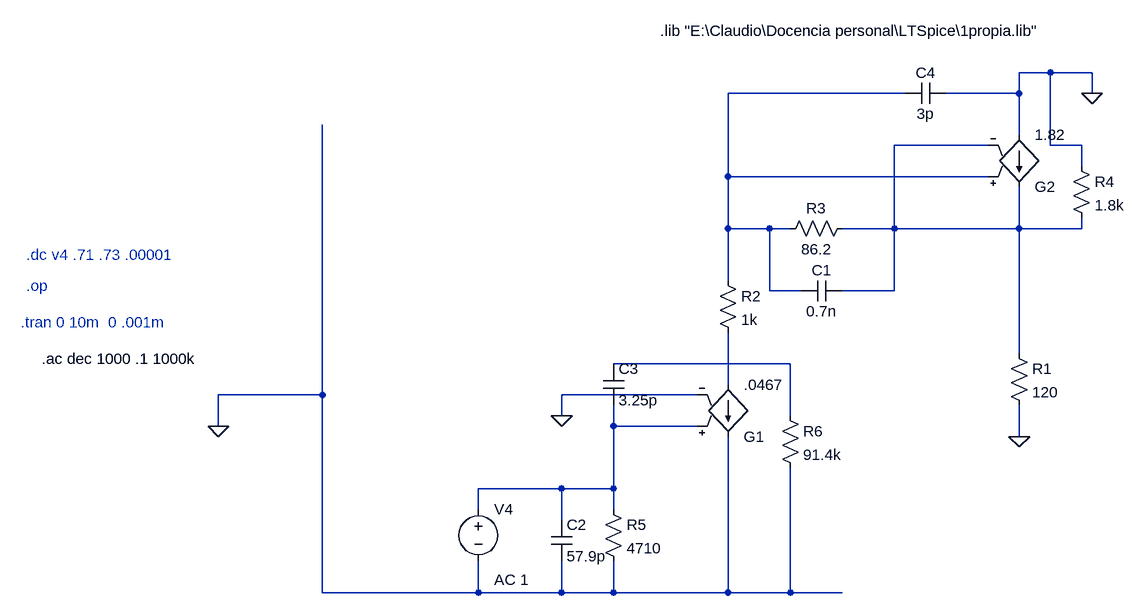
[diagram p0: schematic clase ab respuesta en frecuencia b.asc]
clase ab respuesta en frecuencia b.asc, the LTspice schematic file:
Version 4
SHEET 1 1392 984
WIRE 608 80 560 80
WIRE 672 80 608 80
WIRE 384 112 112 112
WIRE 560 112 560 80
WIRE 560 112 448 112
WIRE 672 112 672 80
WIRE 560 176 560 112
WIRE 512 192 368 192
WIRE 608 192 608 80
WIRE 656 192 608 192
WIRE 656 224 656 192
WIRE 112 240 112 112
WIRE 512 240 112 240
WIRE 112 320 112 240
WIRE 176 320 112 320
WIRE 208 320 176 320
WIRE 368 320 368 192
WIRE 368 320 288 320
WIRE 560 320 560 256
WIRE 560 320 368 320
WIRE 656 320 656 304
WIRE 656 320 560 320
WIRE 112 400 112 320
WIRE 176 416 176 320
WIRE 224 416 176 416
WIRE 368 416 368 320
WIRE 368 416 288 416
WIRE 560 512 560 320
WIRE 208 528 -64 528
WIRE 112 560 112 480
WIRE -512 576 -512 160
WIRE -512 576 -672 576
WIRE 64 576 -144 576
WIRE -144 608 -144 576
WIRE 208 608 208 528
WIRE -672 624 -672 576
WIRE -64 624 -64 592
WIRE 64 624 -64 624
WIRE 560 640 560 592
WIRE -144 720 -272 720
WIRE -64 720 -64 624
WIRE -64 720 -144 720
WIRE -272 752 -272 720
WIRE -64 752 -64 720
WIRE -144 768 -144 720
WIRE -512 880 -512 576
WIRE -272 880 -272 832
WIRE -272 880 -512 880
WIRE -144 880 -144 832
WIRE -144 880 -272 880
WIRE -64 880 -64 832
WIRE -64 880 -144 880
WIRE 112 880 112 640
WIRE 112 880 -64 880
WIRE 208 880 208 688
WIRE 208 880 112 880
WIRE 288 880 208 880
FLAG -672 624 0
FLAG 560 640 0
FLAG -144 608 0
FLAG 672 112 0
DATAFLAG 560 480 ""
SYMBOL res 544 496 R0
SYMATTR InstName R1
SYMATTR Value 120
SYMBOL voltage -272 736 R0
WINDOW 123 24 124 Left 2
WINDOW 39 0 0 Left 0
SYMATTR Value2 AC 1
SYMATTR InstName V4
SYMATTR Value ""
SYMBOL res -80 736 R0
SYMATTR InstName R5
SYMATTR Value 4710
SYMBOL g 112 656 M180
SYMATTR InstName G1
SYMATTR Value .0467
SYMBOL cap -160 768 R0
SYMATTR InstName C2
SYMATTR Value 57.9p
SYMBOL cap -80 528 R0
SYMATTR InstName C3
SYMATTR Value 3.25p
SYMBOL res 192 592 R0
SYMATTR InstName R6
SYMATTR Value 91.4k
SYMBOL res 96 384 R0
SYMATTR InstName R2
SYMATTR Value 1k
SYMBOL res 304 304 R90
WINDOW 0 0 56 VBottom 2
WINDOW 3 32 56 VTop 2
SYMATTR InstName R3
SYMATTR Value 86.2
SYMBOL cap 288 400 R90
WINDOW 0 0 32 VBottom 2
WINDOW 3 32 32 VTop 2
SYMATTR InstName C1
SYMATTR Value 0.7n
SYMBOL g 560 272 M180
SYMATTR InstName G2
SYMATTR Value 1.82
SYMBOL cap 448 96 R90
WINDOW 0 0 32 VBottom 2
WINDOW 3 32 32 VTop 2
SYMATTR InstName C4
SYMATTR Value 3p
SYMBOL res 640 208 R0
SYMATTR InstName R4
SYMATTR Value 1.8k
TEXT 8 16 Left 2 !.lib "E:\\Claudio\\Docencia personal\\LTSpice\\1propia.lib"
TEXT -976 464 Left 2 ;.tran 0 10m  0 .001m
TEXT -968 408 Left 2 ;.op
TEXT -968 360 Left 2 ;.dc v4 .71 .73 .00001
TEXT -944 520 Left 2 !.ac dec 1000 .1 1000k

The netlist it stands for:
* clase ab respuesta en frecuencia b.asc
R1 N002 0 120
V4 N005 0 AC 1
R5 N005 0 4710
G1 N004 0 N005 0 .0467
C2 N005 0 57.9p
C3 N003 N005 3.25p
R6 N003 0 91.4k
R2 N001 N004 1k
R3 N002 N001 86.2
C1 N002 N001 0.7n
G2 0 N002 N001 N002 1.82
C4 0 N001 3p
R4 0 N002 1.8k
.lib "E:\Claudio\Docencia personal\LTSpice\1propia.lib"
* .tran 0 10m  0 .001m
* .op
* .dc v4 .71 .73 .00001
.ac dec 1000 .1 1000k
.backanno
.end